# Altium schematic sheet ADC-ICHANNEL GAIN CONTROL.SchDoc: <SPECIFIC SHEET FUNCTION>
size A3; Date: DO NOT USE, RATHER USE PROJ OPTIONS; DrawnBy: DO NOT USE, RATHER USE PROJ OPTIONS; Engineer: DO NOT USE, RATHER USE PROJ OPTIONS; Organization: DO NOT USE, RATHER USE PROJ OPTIONS; DocumentNumber: 7; Revision: DO NOT USE, RATHER USE PROJ OPTIONS; SheetNumber: 7; SheetTotal: 12; SCH_Sheet_Filename: ADC-ICHANNEL GAIN CONTROL.SchDoc; CurrentTime: DO NOT USE, RATHER USE PROJ OPTIONS; Time: DO NOT USE, RATHER USE PROJ OPTIONS; DocumentFullPathAndName: DO NOT USE, RATHER USE PROJ OPTIONS; DocumentName: DO NOT USE, RATHER USE PROJ OPTIONS; ModifiedDate: DO NOT USE, RATHER USE PROJ OPTIONS; ImagePath: DO NOT USE, RATHER USE PROJ OPTIONS
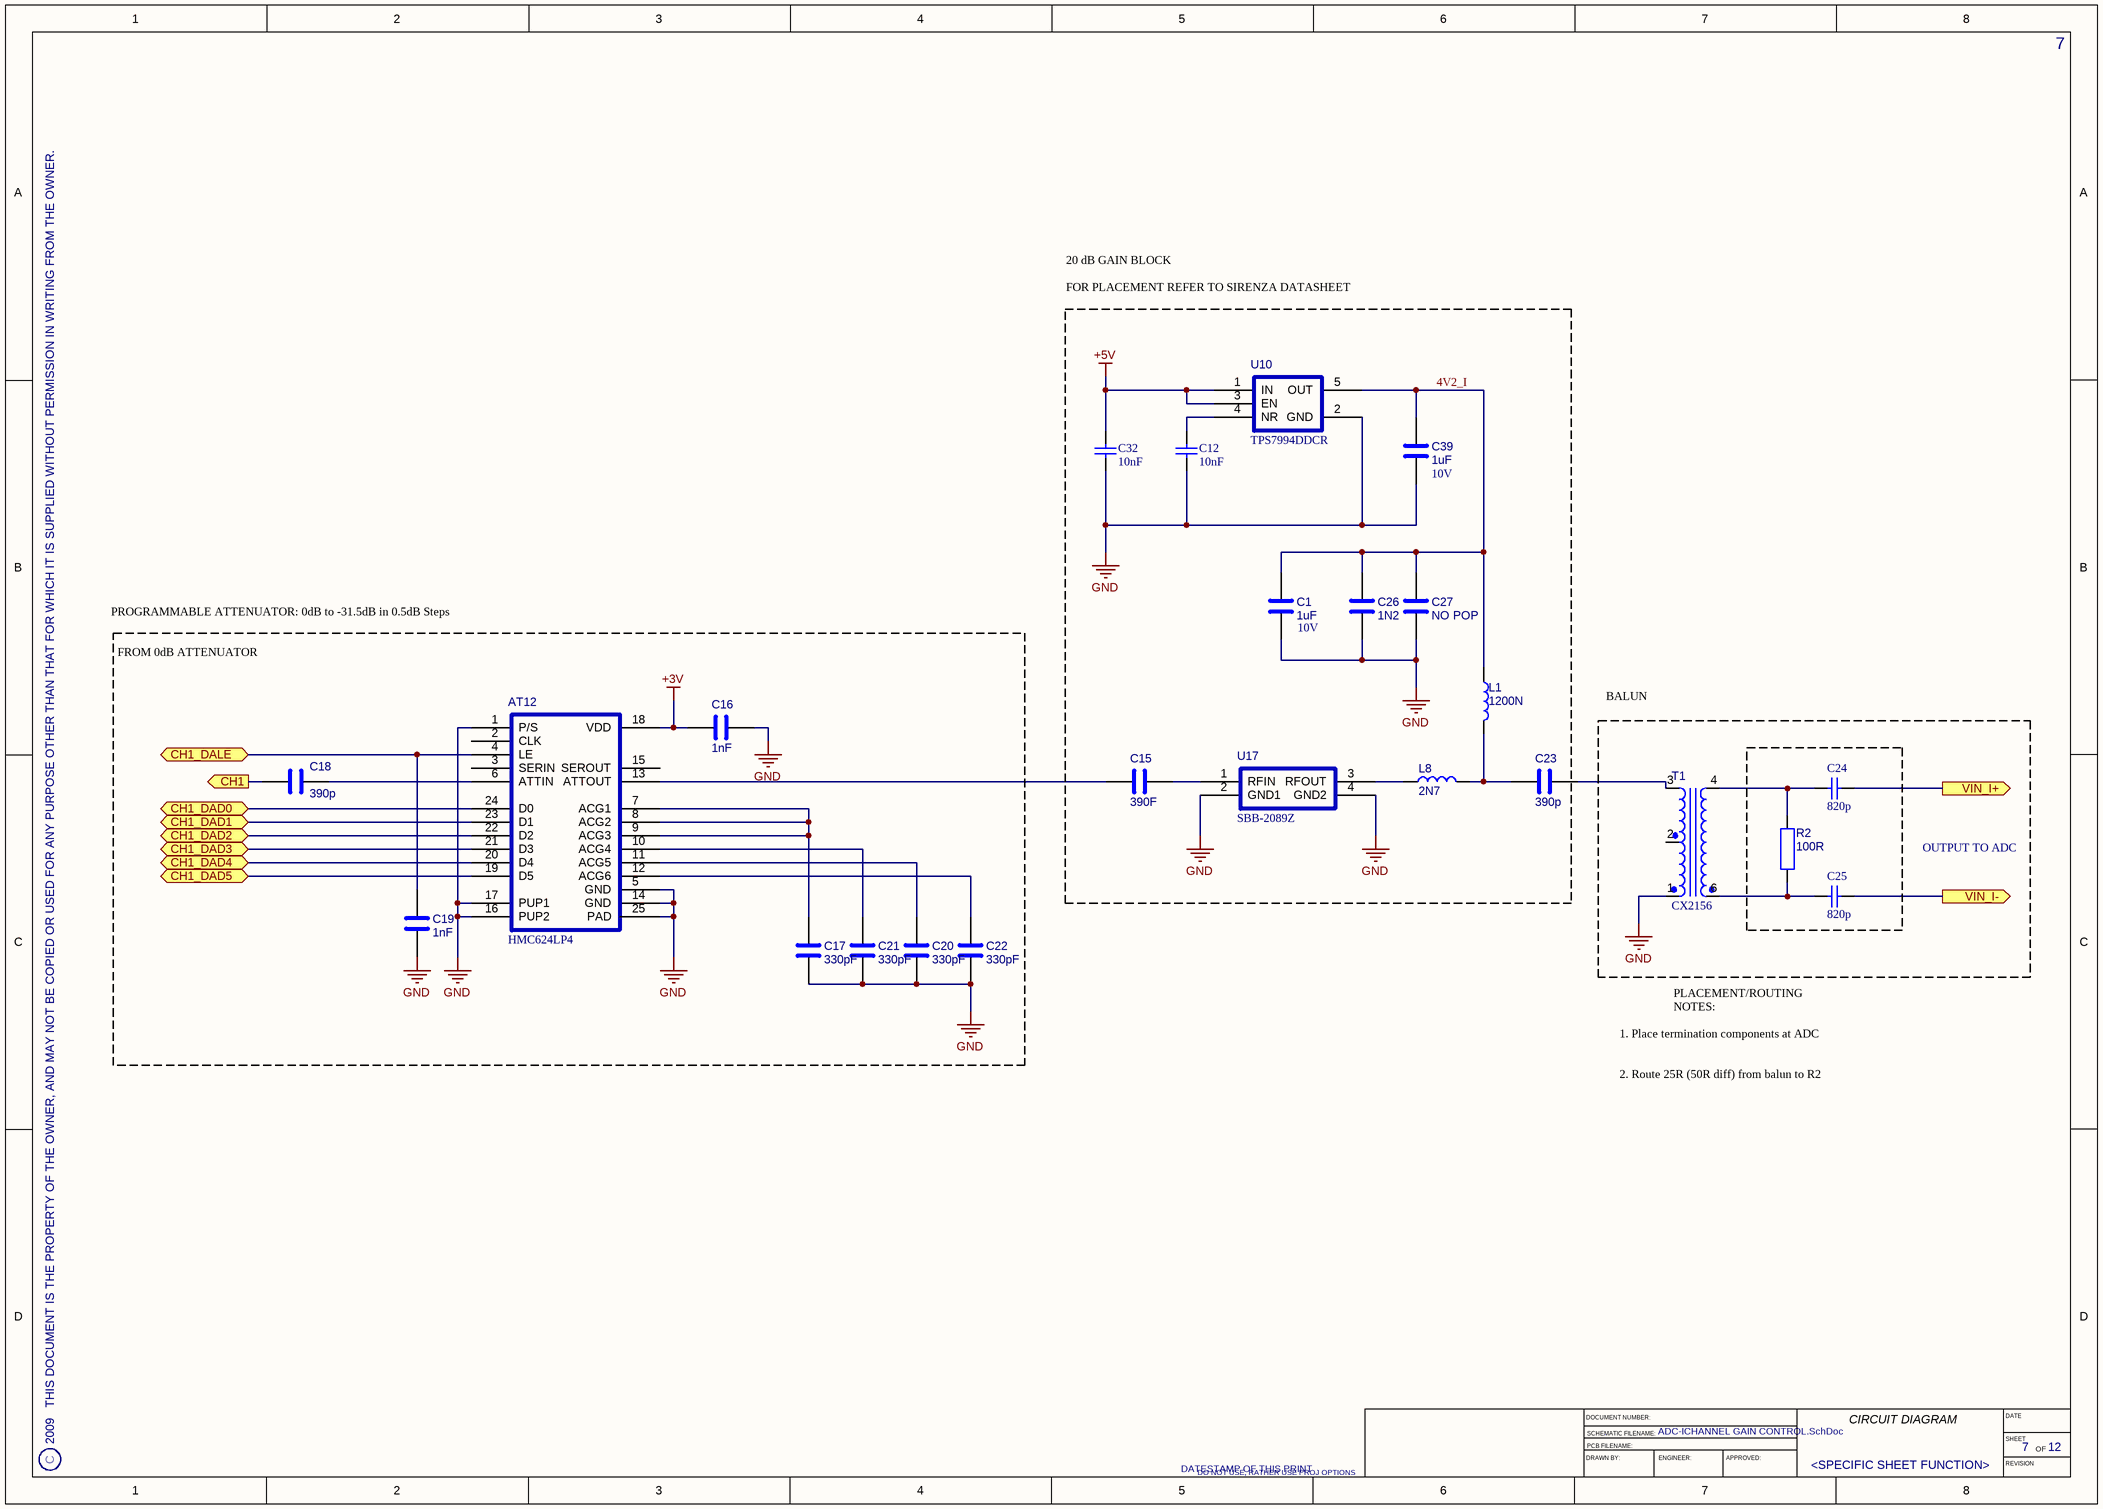
[diagram p0: ADC-ICHANNEL GAIN CONTROL.SchDoc]

## Parts
AT12  HMC624LP4  [QFN50P400X400X100-25USR]
C1  value 1uF  Voltage: 10V  [CAPC1632X80USR]  (hidden comment: Footprint ???)
C12  value 10nF  [CAPC1005X55N]  (hidden comment: Capacitor 0402 SMD)
C15  value 390F  [CAPC1005X55N]  (hidden comment: Footprint ???)
C16  value 1nF  [0603]  (hidden comment: Footprint ???)
C17  value 330pF  [0603]  (hidden comment: Footprint ???)
C18  value 390p  [CAPC1005X55N]  (hidden comment: *)
C19  value 1nF  [0603]  (hidden comment: *)
C20  value 330pF  [0603]  (hidden comment: Footprint ???)
C21  value 330pF  [0603]  (hidden comment: Footprint ???)
C22  value 330pF  [0603]  (hidden comment: Footprint ???)
C23  value 390p  [CAPC1005X55N]  (hidden comment: Footprint ???)
C24  value 820p  [CAPC1005X55N]  (hidden comment: Capacitor 0402 SMD)
C25  value 820p  [CAPC1005X55N]  (hidden comment: Capacitor 0402 SMD)
C26  value 1N2  [CAPC1005X55N]  (hidden comment: *)
C27  value NO POP  [CAPC1005X55N]  (hidden comment: Footprint ???)
C32  value 10nF  [CAPC1005X55N]  (hidden comment: Capacitor 0402 SMD)
C39  value 1uF  Voltage: 10V  [CAPC1632X80USR]  (hidden comment: Footprint ???)
L1  1200N  [INDM2520X160N]
L8  value 2N7  [INDC1005X60N]
R2  value 100R  [RESC1005X40N]  (hidden comment: *)
T1  CX2156  [PULSE_KAYAK]
U10  TPS7994DDCR  [SOT95P280X110-5USR2]
U17  SBB-2089Z  [SIRENZA_SOT89]

## Blocks framed on the sheet
OUTPUT TO ADC: C24 C25 R2 T1

## Ports
CH1 (out), CH1_DAD0, CH1_DAD1, CH1_DAD2, CH1_DAD3, CH1_DAD4, CH1_DAD5, CH1_DALE, VIN_I+ (out), VIN_I- (out)

## Nets
+3V: AT12.18(VDD) C16.1
+5V: C32.1 U10.1(IN) U10.3(EN)
GND: AT12.1(P/S) AT12.5(GND) AT12.14(GND) AT12.16(PUP2) AT12.17(PUP1) AT12.25(PAD) C1.2 C12.2 C16.2 C17.2 C19.2 C20.2 C21.2 C22.2 C26.2 C27.2 C32.2 C39.2 T1.1 U10.2(GND) U17.2(GND1) U17.4(GND2)
4V2_I: C1.1 C26.1 C27.1 C39.1 L1.1 U10.5(OUT)
CH1: C18.1 ; port CH1
CH1_DAD0: AT12.24(D0) ; port CH1_DAD0
CH1_DAD1: AT12.23(D1) ; port CH1_DAD1
CH1_DAD2: AT12.22(D2) ; port CH1_DAD2
CH1_DAD3: AT12.21(D3) ; port CH1_DAD3
CH1_DAD4: AT12.20(D4) ; port CH1_DAD4
CH1_DAD5: AT12.19(D5) ; port CH1_DAD5
CH1_DALE: AT12.4(LE) C19.1 ; port CH1_DALE
VIN_I+: C24.2 ; port VIN_I+
VIN_I-: C25.2 ; port VIN_I-
NetAT12_6: AT12.6(ATTIN) C18.2
NetAT12_7: AT12.7(ACG1) AT12.8(ACG2) AT12.9(ACG3) C17.1
NetAT12_10: AT12.10(ACG4) C21.1
NetAT12_11: AT12.11(ACG5) C20.1
NetAT12_12: AT12.12(ACG6) C22.1
NetAT12_13: AT12.13(ATTOUT) C15.1
NetC12_1: C12.1 U10.4(NR)
NetC15_2: C15.2 U17.1(RFIN)
NetC23_1: C23.1 L1.2 L8.2
NetC23_2: C23.2 T1.3
NetC24_1: C24.1 R2.1 T1.4
NetC25_1: C25.1 R2.2 T1.6
NetL8_1: L8.1 U17.3(RFOUT)

Not connected (* = marked no-connect by the designer): AT12 2(CLK) 3(SERIN) 15(SEROUT); T1 2

## Notes on the sheet
- 20 dB GAIN BLOCK
- FOR PLACEMENT REFER TO SIRENZA DATASHEET
- PROGRAMMABLE ATTENUATOR: 0dB to -31.5dB in 0.5dB Steps
- FROM 0dB ATTENUATOR
- BALUN
- 1. Place termination components at ADC
- PLACEMENT/ROUTING NOTES:
- 2. Route 25R (50R diff) from balun to R2
- 2009   THIS DOCUMENT IS THE PROPERTY OF THE OWNER, AND MAY NOT BE COPIED OR USED FOR ANY PURPOSE OTHER THAN THAT FOR WHICH IT IS SUPPLIED WITHOUT PERMISSION IN WRITING FROM THE OWNER.
- C
- DATESTAMP OF THIS PRINT
- DRAWN BY:
- DOCUMENT NUMBER:
- SCHEMATIC FILENAME:
- PCB FILENAME:
- ENGINEER:
- APPROVED:
- CIRCUIT DIAGRAM
- DATE
- SHEET
- REVISION
- OF

## Library data of the parts
AT12 = HMC624LP4: Broadband 6-bit IC Digital Attenuator; Manufacturer: Hittite; Created_By: IN; Checked_By: NN; Manufacturer_PN: HMC624LP4; Checked_Date: NN-08-2009; HelpURL: X:\Datasheets\By_Manufacturer\Hittite\hmc624lp4.pdf; ComponentLink1Description: Footprint Detail; ComponentLink1URL: X:\Datasheets\By_Manufacturer\Hittite\hmc624lp4.pdf#page=6; ComponentLink2Description: Application Note; ComponentLink2URL: *; ComponentLink3Description: Layout Guidelines; ComponentLink3URL: X:\Datasheets\By_Manufacturer\Hittite\hmc624lp4.pdf#page=9; ComponentLink4Description: Technology Reference; ComponentLink4URL: *; Supplier1: *; Supplier2: *; Unit_Cost: *; MOQ: *; Leadtime: *; Inventory_Stock: *; Tolerance: *; Wattage: *; Voltage: *; Package: QFN24; ComponentLink5Description: Production Detail; ComponentLink5URL: *; Note: *; Stock Code: *
C1 C15-C23 C26 C27 C39 = CAP-0603: CAP SMD 0603; Manufacturer: *; Manufacturer_PN: *; Created_By: *; Checked_By: *; Checked_Date: *; HelpURL: *; ComponentLink1Description: Footprint Detail; ComponentLink1URL: *; ComponentLink2Description: Application Note; ComponentLink2URL: *; ComponentLink3Description: Layout Guidelines; ComponentLink3URL: *; ComponentLink4Description: Technology Reference; ComponentLink4URL: *; Supplier1: *; Supplier2: *; Unit_Cost: *; MOQ: *; Leadtime: *; Inventory_Stock: *; Tolerance: *; Package: 0603; ComponentLink5Description: Production Detail; ComponentLink5URL: *; Note: *; Stock Code: *
  C1: Wattage: 10V
  C15-C23 C26 C27: Wattage: *; Voltage: *
  C39: Wattage: *
C12 C24 C25 C32 = cap0402: Created_By: EDA-ASA; Checked_By: *; Checked_Date: *; HelpURL: *; Supplier1: *; Supplier2: *; Unit_Cost: *; MOQ: *; Leadtime: *; Inventory_Stock: *; Tolerance: *; Wattage: *; Package: 0402; ComponentLinked1Description: *; ComponentLinked1URL: *; ComponentLinked2Description: *; ComponentLinked2URL: *; ComponentLinked3Description: *; ComponentLinked3URL: *; ComponentLinked4Description: *; ComponentLinked4URL: *
L1 L8 = CHOKE: Created_By: EDA-ASA; Checked_By: *; Checked_Date: *; HelpURL: *; ComponentLinked1Description: *; ComponentLinked1URL: *; ComponentLinked2Description: *; ComponentLinked2URL: *; ComponentLinked3Description: *; ComponentLinked3URL: *; ComponentLinked4Description: *; ComponentLinked4URL: *; Supplier1: *; Supplier2: *; Unit_Cost: *; MOQ: *; Leadtime: *; Inventory_Stock: *; Tolerance: *; Wattage: *
  L1: Value: 1200N
R2 = RES-0805: RESISTOR SMD 0805; Checked_By: NN; Manufacturer: *; Manufacturer_PN: *; Created_By: *; Checked_Date: 5-08-2009; HelpURL: *; ComponentLink1Description: Footprint Detail; ComponentLink1URL: *; ComponentLink2Description: Application Note; ComponentLink2URL: *; ComponentLink3Description: Layout Guidelines; ComponentLink3URL: *; ComponentLink4Description: Technology Reference; ComponentLink4URL: *; Supplier1: *; Supplier2: *; Unit_Cost: *; MOQ: *; Leadtime: *; Inventory_Stock: *; Tolerance: *; Wattage: *; Voltage: *; Package: 0805; ComponentLink5Description: Production Detail; ComponentLink5URL: *; Note: *; Stock Code: *
T1 = CX2156: TRANSFORMER WIDEBAND RF APPLICATION; Voltage: ???; Manufacturer: *; Created_By: *; Checked_By: *; Checked_Date: *; HelpURL: *; ComponentLink1Description: TRANSFORMER WIDEBAND RF APPLICATION; ComponentLink1URL: *; ComponentLink2Description: Application Note; ComponentLink2URL: *; ComponentLink3Description: Layout Guidelines; ComponentLink3URL: *; ComponentLink4Description: Technology Reference; ComponentLink4URL: *; Supplier1: *; Supplier2: *; Unit_Cost: *; MOQ: *; Leadtime: *; Inventory_Stock: *; Tolerance: *; Wattage: *; Package: *; ComponentLink5Description: Production Detail; ComponentLink5URL: *; Note: *; Stock Code: *; Manufacturer_PN: CX2156
U10 = TPS7994DDCR: Low Quiescent Current, Ultra-Low Noise Dropout Linear Regulator; Manufacturer: TI; Created_By: IN; Manufacturer_PN: TPS7994DDCR; Checked_By: *; Checked_Date: *; HelpURL: X:\Datacheets\By_Manufacture\TI\296-17776-2.pdf; ComponentLink1Description: Footprint Detail; ComponentLink1URL: *; ComponentLink2Description: Application Note; ComponentLink2URL: *; ComponentLink3Description: Layout Guidelines; ComponentLink3URL: *; ComponentLink4Description: Technology Reference; ComponentLink4URL: *; Supplier1: *; Supplier2: *; Unit_Cost: *; MOQ: *; Leadtime: *; Inventory_Stock: *; Tolerance: *; Wattage: *; Voltage: *; Package: *; ComponentLink5Description: Production Detail; ComponentLink5URL: *; Note: *; Stock Code: *
U17 = SBB-2089Z: High performance InaGaP HBT MMIC amplfier; Manufacturer: Sirenza Micodevices; Created_By: IN; Manufacturer_PN: SBB-2089Z; Checked_By: *; Checked_Date: *; HelpURL: X:\Datasheets\By_Manufacturer\Sirenza\SBB-2089(Z)_Datasheet.pdf; ComponentLink1Description: Footprint Detail; ComponentLink1URL: X:\Datasheets\By_Manufacturer\Sirenza\SBB-2089(Z)_Datasheet.pdf#Page=5; ComponentLink2Description: Application Note; ComponentLink2URL: *; ComponentLink3Description: Layout Guidelines; ComponentLink3URL: *; ComponentLink4Description: Technology Reference; ComponentLink4URL: *; Supplier1: *; Supplier2: *; Unit_Cost: *; MOQ: *; Leadtime: *; Inventory_Stock: *; Tolerance: *; Wattage: *; Voltage: *; Package: *; ComponentLink5Description: Production Detail; ComponentLink5URL: *; Note: *; Stock Code: *